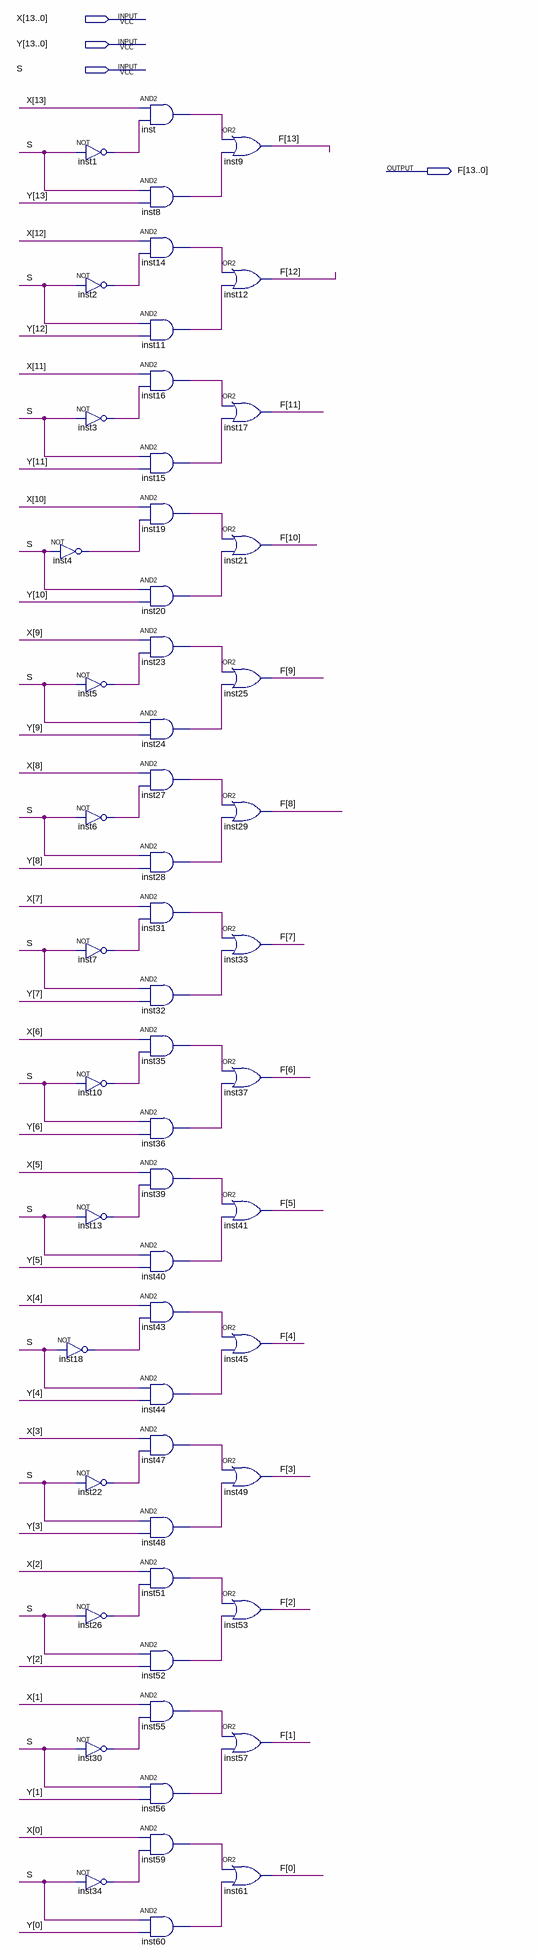
[diagram p0: schematic sheet]
// Quartus schematic G19_14MUX.bdf as structural Verilog: 56 symbols, 4 pins
module G19_14MUX (
  input  [13:0] X,
  input  [13:0] Y,
  input  S,
  output [13:0] F
);

  wire inst1_out, inst2_out, inst3_out, inst4_out, inst5_out, inst6_out, inst7_out, inst8_out, inst10_out,
       inst11_out, inst13_out, inst14_out, inst15_out, inst16_out, inst18_out, inst19_out, inst20_out,
       inst22_out, inst23_out, inst24_out, inst26_out, inst27_out, inst28_out, inst30_out, inst31_out,
       inst32_out, inst34_out, inst35_out, inst36_out, inst39_out, inst40_out, inst43_out, inst44_out,
       inst47_out, inst48_out, inst51_out, inst52_out, inst55_out, inst56_out, inst59_out, inst60_out,
       inst_out;

  not inst4 (inst4_out, S);
  not inst1 (inst1_out, S);
  not inst2 (inst2_out, S);
  not inst3 (inst3_out, S);
  not inst5 (inst5_out, S);
  not inst6 (inst6_out, S);
  not inst7 (inst7_out, S);
  not inst10 (inst10_out, S);
  not inst13 (inst13_out, S);
  not inst18 (inst18_out, S);
  not inst22 (inst22_out, S);
  not inst26 (inst26_out, S);
  not inst30 (inst30_out, S);
  not inst34 (inst34_out, S);
  and inst (inst_out, X[13], inst1_out);
  and inst8 (inst8_out, S, Y[13]);
  and inst14 (inst14_out, X[12], inst2_out);
  and inst11 (inst11_out, S, Y[12]);
  and inst16 (inst16_out, X[11], inst3_out);
  and inst15 (inst15_out, S, Y[11]);
  and inst19 (inst19_out, X[10], inst4_out);
  and inst20 (inst20_out, S, Y[10]);
  and inst23 (inst23_out, X[9], inst5_out);
  and inst24 (inst24_out, S, Y[9]);
  and inst27 (inst27_out, X[8], inst6_out);
  and inst28 (inst28_out, S, Y[8]);
  and inst31 (inst31_out, X[7], inst7_out);
  and inst32 (inst32_out, S, Y[7]);
  and inst35 (inst35_out, X[6], inst10_out);
  and inst36 (inst36_out, S, Y[6]);
  and inst39 (inst39_out, X[5], inst13_out);
  and inst40 (inst40_out, S, Y[5]);
  and inst43 (inst43_out, X[4], inst18_out);
  and inst44 (inst44_out, S, Y[4]);
  and inst47 (inst47_out, X[3], inst22_out);
  and inst48 (inst48_out, S, Y[3]);
  and inst51 (inst51_out, X[2], inst26_out);
  and inst52 (inst52_out, S, Y[2]);
  and inst55 (inst55_out, X[1], inst30_out);
  and inst56 (inst56_out, S, Y[1]);
  and inst59 (inst59_out, X[0], inst34_out);
  and inst60 (inst60_out, S, Y[0]);
  or inst9 (F[13], inst_out, inst8_out);
  or inst12 (F[12], inst14_out, inst11_out);
  or inst17 (F[11], inst16_out, inst15_out);
  or inst21 (F[10], inst19_out, inst20_out);
  or inst25 (F[9], inst23_out, inst24_out);
  or inst29 (F[8], inst27_out, inst28_out);
  or inst33 (F[7], inst31_out, inst32_out);
  or inst37 (F[6], inst35_out, inst36_out);
  or inst41 (F[5], inst39_out, inst40_out);
  or inst45 (F[4], inst43_out, inst44_out);
  or inst49 (F[3], inst47_out, inst48_out);
  or inst53 (F[2], inst51_out, inst52_out);
  or inst57 (F[1], inst55_out, inst56_out);
  or inst61 (F[0], inst59_out, inst60_out);
endmodule
